# Altium project M2RB.PrjPcb (part 2 of 2)

## Sheet RF DAC.SchDoc
size B
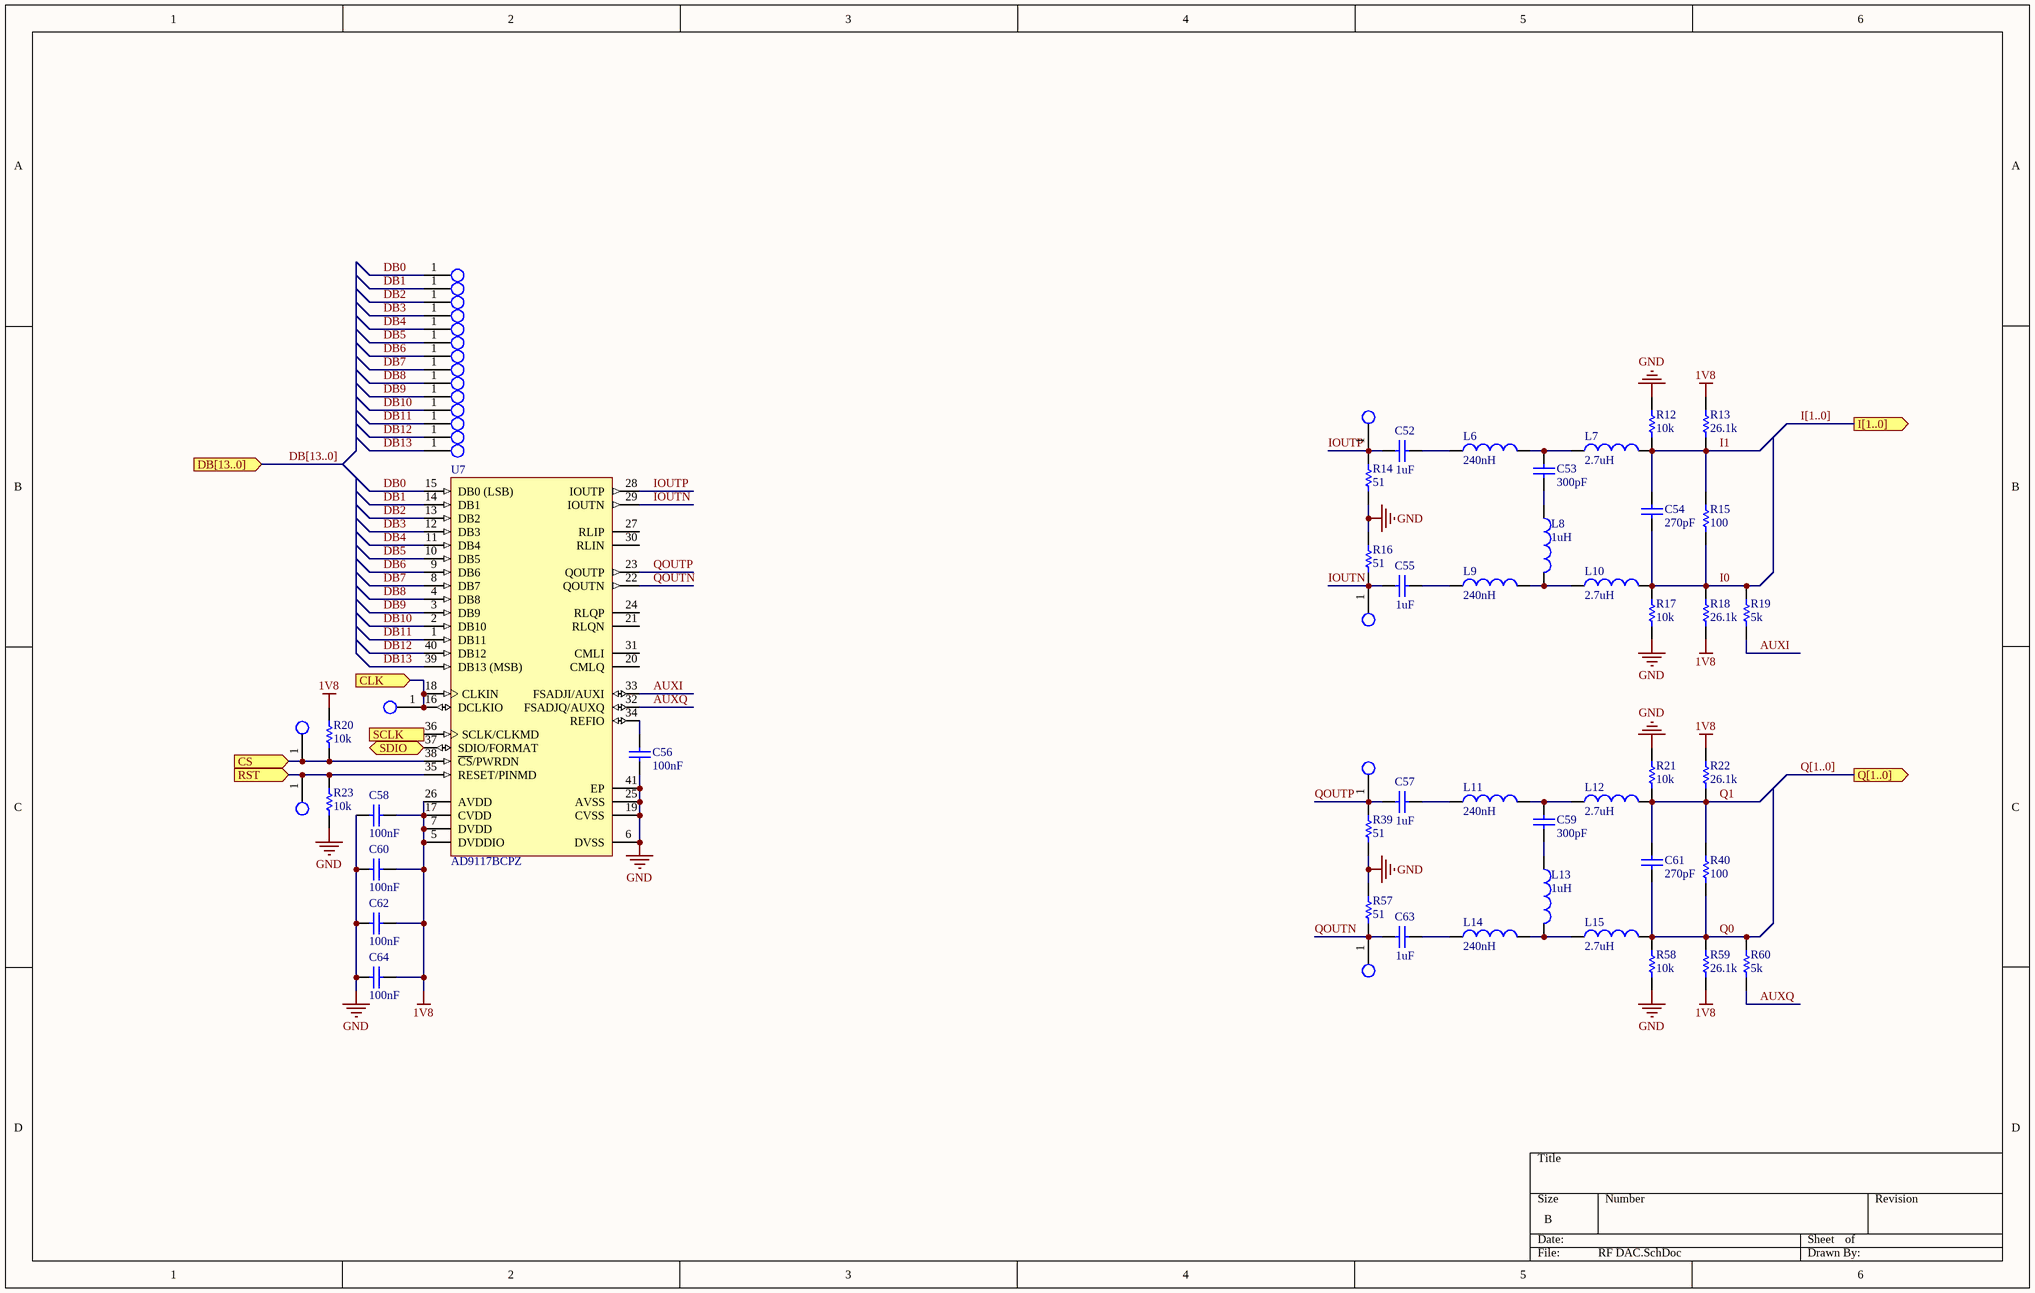
[diagram p14: RF DAC.SchDoc]

### Parts
C52  value 1uF  [1608[0603]]  (hidden comment: Cap)
C53  value 300pF  [0402-A]  (hidden comment: Cap)
C54  value 270pF  [0402-A]  (hidden comment: Cap)
C55  value 1uF  [1608[0603]]  (hidden comment: Cap)
C56  value 100nF  [0402-A]  (hidden comment: Cap)
C57  value 1uF  [1608[0603]]  (hidden comment: Cap)
C58  value 100nF  [0402-A]  (hidden comment: Cap)
C59  value 300pF  [0402-A]  (hidden comment: Cap)
C60  value 100nF  [0402-A]  (hidden comment: Cap)
C61  value 270pF  [0402-A]  (hidden comment: Cap)
C62  value 100nF  [0402-A]  (hidden comment: Cap)
C63  value 1uF  [1608[0603]]  (hidden comment: Cap)
C64  value 100nF  [0402-A]  (hidden comment: Cap)
CLK  5029  [EXPOSED PAD 0.02X0.02]  (value not drawn)
CLK3  5029  [EXPOSED PAD 0.02X0.02]  (value not drawn)
CLK4  5029  [EXPOSED PAD 0.02X0.02]  (value not drawn)
DB0  5029  [EXPOSED PAD 0.02X0.02]  (value not drawn)
DB1  5029  [EXPOSED PAD 0.02X0.02]  (value not drawn)
DB2  5029  [EXPOSED PAD 0.02X0.02]  (value not drawn)
DB3  5029  [EXPOSED PAD 0.02X0.02]  (value not drawn)
DB4  5029  [EXPOSED PAD 0.02X0.02]  (value not drawn)
DB5  5029  [EXPOSED PAD 0.02X0.02]  (value not drawn)
DB6  5029  [EXPOSED PAD 0.02X0.02]  (value not drawn)
DB7  5029  [EXPOSED PAD 0.02X0.02]  (value not drawn)
DB8  5029  [EXPOSED PAD 0.02X0.02]  (value not drawn)
DB9  5029  [EXPOSED PAD 0.02X0.02]  (value not drawn)
DB10  5029  [EXPOSED PAD 0.02X0.02]  (value not drawn)
DB11  5029  [EXPOSED PAD 0.02X0.02]  (value not drawn)
DB12  5029  [EXPOSED PAD 0.02X0.02]  (value not drawn)
DB13  5029  [EXPOSED PAD 0.02X0.02]  (value not drawn)
J22  5029  [EXPOSED PAD 0.02X0.02]  (value not drawn)
J25  5029  [EXPOSED PAD 0.02X0.02]  (value not drawn)
J26  5029  [EXPOSED PAD 0.02X0.02]  (value not drawn)
J29  5029  [EXPOSED PAD 0.02X0.02]  (value not drawn)
L6  value 240nH  [0402-A]  (hidden comment: Inductor)
L7  value 2.7uH  [1608[0603]]  (hidden comment: Inductor)
L8  value 1uH  [1608[0603]]  (hidden comment: Inductor)
L9  value 240nH  [0402-A]  (hidden comment: Inductor)
L10  value 2.7uH  [1608[0603]]  (hidden comment: Inductor)
L11  value 240nH  [0402-A]  (hidden comment: Inductor)
L12  value 2.7uH  [1608[0603]]  (hidden comment: Inductor)
L13  value 1uH  [1608[0603]]  (hidden comment: Inductor)
L14  value 240nH  [0402-A]  (hidden comment: Inductor)
L15  value 2.7uH  [1608[0603]]  (hidden comment: Inductor)
R12  value 10k  [0402-A]  (hidden comment: Res1)
R13  value 26.1k  [0402-A]  (hidden comment: Res1)
R14  value 51  [0402-A]  (hidden comment: Res1)
R15  value 100  [0402-A]  (hidden comment: Res1)
R16  value 51  [0402-A]  (hidden comment: Res1)
R17  value 10k  [0402-A]  (hidden comment: Res1)
R18  value 26.1k  [0402-A]  (hidden comment: Res1)
R19  value 5k  [0402-A]  (hidden comment: Res1)
R20  value 10k  [0402-A]  (hidden comment: Res1)
R21  value 10k  [0402-A]  (hidden comment: Res1)
R22  value 26.1k  [0402-A]  (hidden comment: Res1)
R23  value 10k  [0402-A]  (hidden comment: Res1)
R39  value 51  [0402-A]  (hidden comment: Res1)
R40  value 100  [0402-A]  (hidden comment: Res1)
R57  value 51  [0402-A]  (hidden comment: Res1)
R58  value 10k  [0402-A]  (hidden comment: Res1)
R59  value 26.1k  [0402-A]  (hidden comment: Res1)
R60  value 5k  [0402-A]  (hidden comment: Res1)
U7  AD9117BCPZ  [CP-40-1_N]

### Ports
CLK (in), CS (in), DB[13..0] (in), I[1..0] (out), Q[1..0] (out), RST (in), SCLK (in), SDIO (bidir)

### Nets
1V8: C58.2 C60.2 C62.2 C64.2 R13.2 R18.1 R20.2 R22.2 R59.1 U7.5(DVDDIO) U7.7(DVDD) U7.17(CVDD) U7.26(AVDD)
GND: C56.1 C58.1 C60.1 C62.1 C64.1 R12.2 R14.1 R16.2 R17.1 R21.2 R23.1 R39.1 R57.2 R58.1 U7.6(DVSS) U7.19(CVSS) U7.25(AVSS) U7.41(EP)
AUXI: R19.1 U7.33(FSADJI/AUXI)
AUXQ: R60.1 U7.32(FSADJQ/AUXQ)
DB0: DB0.1 U7.15(DB0_(LSB))
DB1: DB1.1 U7.14(DB1)
DB2: DB2.1 U7.13(DB2)
DB3: DB3.1 U7.12(DB3)
DB4: DB4.1 U7.11(DB4)
DB5: DB5.1 U7.10(DB5)
DB6: DB6.1 U7.9(DB6)
DB7: DB7.1 U7.8(DB7)
DB8: DB8.1 U7.4(DB8)
DB9: DB9.1 U7.3(DB9)
DB10: DB10.1 U7.2(DB10)
DB11: DB11.1 U7.1(DB11)
DB12: DB12.1 U7.40(DB12)
DB13: DB13.1 U7.39(DB13_(MSB))
I0: C54.2 L10.2 R15.1 R17.2 R18.2 R19.2
I1: C54.1 L7.2 R12.1 R13.1 R15.2
IOUTN: C55.2 J25.1 R16.1 U7.29(IOUTN)
IOUTP: C52.2 J22.1 R14.2 U7.28(IOUTP)
Q0: C61.2 L15.2 R40.1 R58.2 R59.2 R60.2
Q1: C61.1 L12.2 R21.1 R22.1 R40.2
QOUTN: C63.2 J29.1 R57.1 U7.22(QOUTN)
QOUTP: C57.2 J26.1 R39.2 U7.23(QOUTP)
NetC52_1: C52.1 L6.1
NetC53_1: C53.1 L6.2 L7.1
NetC53_2: C53.2 L8.1
NetC55_1: C55.1 L9.1
NetC56_2: C56.2 U7.34(REFIO)
NetC57_1: C57.1 L11.1
NetC59_1: C59.1 L11.2 L12.1
NetC59_2: C59.2 L13.1
NetC63_1: C63.1 L14.1
NetCLK1_1: U7.36(SCLK/CLKMD) ; port SCLK
NetCLK2_1: U7.37(SDIO/FORMAT) ; port SDIO
NetCLK3_1: CLK3.1 R20.1 U7.38(~{CS}/PWRDN) ; port CS
NetCLK4_1: CLK4.1 R23.2 U7.35(RESET/PINMD) ; port RST
NetCLK_1: CLK.1 U7.16(DCLKIO) U7.18(CLKIN) ; port CLK
NetL8_2: L8.2 L9.2 L10.1
NetL13_2: L13.2 L14.2 L15.1

Not connected (* = marked no-connect by the designer): U7 20(CMLQ) 21(RLQN) 24(RLQP) 27(RLIP) 30(RLIN) 31(CMLI)

### Buses and harness runs
bus DB[13..0] = port DB[13..0]
bus I[1..0] = port I[1..0]
bus Q[1..0] = port Q[1..0]

### Library data of the parts
C52-C64 = Cap: Capacitor; Published: 8-Jun-2000; LatestRevisionDate: 17-Jul-2002; LatestRevisionNote: Re-released for DXP Platform.; PackageReference: RAD-0.3; Publisher: Altium Limited; PackageDescription: Radial Cap, Thru-Hole; 2 Leads; 0.3 in Pin Spacing
L6-L15 = Inductor: Code_IEC: 1005; Published: 8-Jun-2000; LatestRevisionDate: 29-May-2009; LatestRevisionNote: IPC-7351 Footprint Added.; PackageReference: 0402-A; Publisher: Altium Limited; PackageDescription: Chip Inductor; Code_JEITA: 0402
R12-R23 R39 R40 R57-R60 = Res1: Resistor; Published: 8-Jun-2000; LatestRevisionDate: 17-Jul-2002; LatestRevisionNote: Re-released for DXP Platform.; PackageReference: AXIAL-0.3; Publisher: Altium Limited; PackageDescription: Axial Device, Thru-Hole; 2 Leads; 0.3 in Pin Spacing
U7 = CMP-0318-00565-2: Dual 14-Bit Low Power TxDAC Digital-to-Analog Converter, 0 to +70 degC, CP-40-1, Pb-Free, Tray; Manufacturer: Analog Devices; Generic Part Number: AD9117; Max V+: 3.3V; Single Supply: Yes; # DAC Outputs: 2; Resolution (Bits): 14; ComponentLink4Description: Product URL; ComponentLink2URL: http://www.analog.com/static/imported-files/data_sheets/AD9114_9115_9116_9117.pdf; Packing: Tray; PackageDescription: 40-Pin Lead Frame Chip Scale Package [LFCSP_VQ] Very Thin Quad; PackageVersion: Oct-2006; ComponentLink1URL: http://www.analog.com/en/index.html; Mounting Technology: Surface Mount; ComponentLink5URL: http://www.analog.com/en/digital-to-analog-converters/da-converters/ad9117/products/product.html#prod_cross_sell; ComponentLink3Description: Package Specification; PartNumber: AD9117BCPZ; PackageReference: CP-40-1; ComponentLink1Description: Manufacturer URL; ComponentLink4URL: http://www.analog.com/en/digital-to-analog-converters/da-converters/ad9117/products/product.html; ComponentLink3URL: http://www.analog.com/static/imported-files/packages/PKG_PDF/LFCSP(CP)/CP_40_1.pdf; ComponentLink2Description: Datasheet; ComponentLink5Description: Reference Design URL; Code_JEDEC: MO-220-VJJD-2; RoHS: Y; RevisionNote: Component URL fixed; DatasheetVersion: Rev.B

## Sheet LO.SchDoc
size C
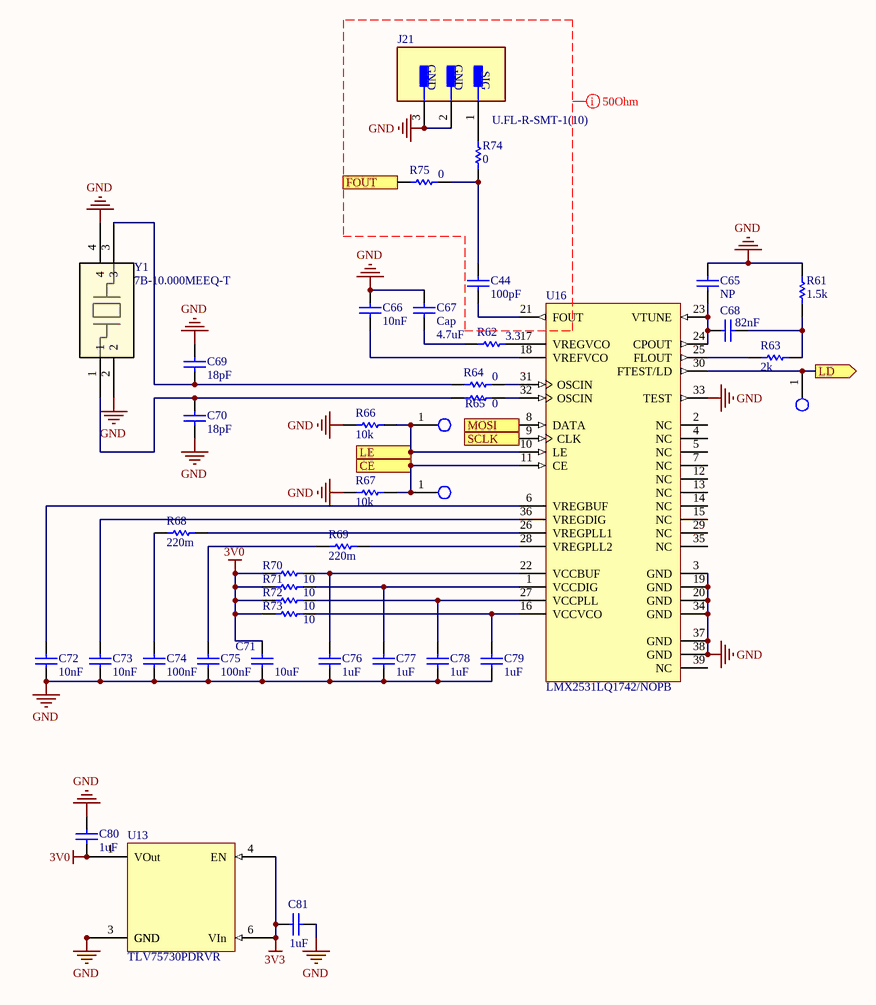
[diagram p15: LO.SchDoc]

### Parts
C44  value 100pF  [0402-A]  (hidden comment: Cap)
C65  value NP  [0402-A]  (hidden comment: Cap)
C66  value 10nF  [0402-A]  (hidden comment: Cap)
C67  Cap  value 4.7uF  [6-0805_M]
C68  value 82nF  [0402-A]  (hidden comment: Cap)
C69  value 18pF  [0402-A]  (hidden comment: Cap)
C70  value 18pF  [0402-A]  (hidden comment: Cap)
C71  value 10uF  [C1206]  (hidden comment: Cap)
C72  value 10nF  [0402-A]  (hidden comment: Cap)
C73  value 10nF  [0402-A]  (hidden comment: Cap)
C74  value 100nF  [0402-A]  (hidden comment: Cap)
C75  value 100nF  [0402-A]  (hidden comment: Cap)
C76  value 1uF  [1608[0603]]  (hidden comment: Cap)
C77  value 1uF  [1608[0603]]  (hidden comment: Cap)
C78  value 1uF  [1608[0603]]  (hidden comment: Cap)
C79  value 1uF  [1608[0603]]  (hidden comment: Cap)
C80  value 1uF  [1608[0603]]  (hidden comment: Cap)
C81  value 1uF  [1608[0603]]  (hidden comment: Cap)
CLK5  5029  [EXPOSED PAD 0.02X0.02]  (value not drawn)
CLK6  5029  [EXPOSED PAD 0.02X0.02]  (value not drawn)
CLK7  5029  [EXPOSED PAD 0.02X0.02]  (value not drawn)
J21  U.FL-R-SMT-1(10)  [FP-U_FL-R-SMT-1_10-MFG]
R61  value 1.5k  [0402-A]  (hidden comment: Res1)
R62  value 3.3  [0402-A]  (hidden comment: Res1)
R63  value 2k  [0402-A]  (hidden comment: Res1)
R64  value 0  [0402-A]  (hidden comment: Res1)
R65  value 0  [0402-A]  (hidden comment: Res1)
R66  value 10k  [0402-A]  (hidden comment: Res1)
R67  value 10k  [0402-A]  (hidden comment: Res1)
R68  value 220m  [0402-A]  (hidden comment: Res1)
R69  value 220m  [0402-A]  (hidden comment: Res1)
R70  value 10  [0402-A]  (hidden comment: Res1)
R71  value 10  [0402-A]  (hidden comment: Res1)
R72  value 10  [0402-A]  (hidden comment: Res1)
R73  value 10  [0402-A]  (hidden comment: Res1)
R74  value 0  [0402-A]  (hidden comment: Res1)
R75  value 0  [0402-A]  (hidden comment: Res1)
U13  TLV75730PDRVR  [TLV75730PDRVR]
U16  LMX2531LQ1742/NOPB  [NJG0036A_V]
Y1  7B-10.000MEEQ-T  [CRYSTAL_TXC_7B]

### Ports
CE (in), FOUT (out), LD (out), LE (in), MOSI (in), SCLK (in)

### Nets
3V0: C71.2 C80.2 R70.2 R71.2 R72.2 R73.2 U13.1(VOut)
3V3: C81.2 U13.4(EN) U13.6(VIn)
GND: C65.1 C66.2 C67.2 C69.2 C70.1 C71.1 C72.1 C73.1 C74.1 C75.1 C76.2 C77.2 C78.2 C79.2 C80.1 C81.1 J21.2(GND) J21.3(GND) R61.1 R66.1 R67.1 U13.3(GND) U13.7(GND) U16.3(GND) U16.19(GND) U16.20(GND) U16.33(TEST) U16.34(GND) U16.37(GND) U16.38(GND) Y1.2 Y1.4
NetC44_1: C44.1 R74.2 R75.1
NetC44_2: C44.2 U16.21(FOUT)
NetC65_2: C65.2 C68.2 U16.23(VTUNE) U16.24(CPOUT)
NetC66_1: C66.1 U16.18(VREFVCO)
NetC67_1: C67.1 R62.2
NetC68_1: C68.1 R61.2 R63.2
NetC69_1: C69.1 R64.2 Y1.3
NetC70_2: C70.2 R65.2 Y1.1
NetC72_2: C72.2 U16.6(VREGBUF)
NetC73_2: C73.2 U16.36(VREGDIG)
NetC74_2: C74.2 R68.2
NetC75_2: C75.2 R69.2
NetC76_1: C76.1 R70.1 U16.22(VCCBUF)
NetC77_1: C77.1 R71.1 U16.1(VCCDIG)
NetC78_1: C78.1 R72.1 U16.27(VCCPLL)
NetC79_1: C79.1 R73.1 U16.16(VCCVCO)
NetCLK1_1: U16.9(CLK) ; port SCLK
NetCLK2_1: U16.8(DATA) ; port MOSI
NetCLK5_1: CLK5.1 U16.30(FTEST/LD) ; port LD
NetCLK6_1: CLK6.1 R66.2 U16.10(LE) ; port LE
NetCLK7_1: CLK7.1 R67.2 U16.11(CE) ; port CE
NetJ21_1: J21.1(SIG) R74.1
NetR62_1: R62.1 U16.17(VREGVCO)
NetR63_1: R63.1 U16.25(FLOUT)
NetR64_1: R64.1 U16.31(OSCIN)
NetR65_1: R65.1 U16.32(OSCIN)
NetR68_1: R68.1 U16.26(VREGPLL1)
NetR69_1: R69.1 U16.28(VREGPLL2)
NetR75_2: R75.2 ; port FOUT

Not connected (* = marked no-connect by the designer): U16 2(NC) 4(NC) 5(NC) 7(NC) 12(NC) 13(NC) 14(NC) 15(NC) 29(NC) 35(NC) 39(NC)

### Layout directives
net class 50Ohm: GND

### Library data of the parts
C44 C65-C81 = Cap: Capacitor; Published: 8-Jun-2000; LatestRevisionDate: 17-Jul-2002; LatestRevisionNote: Re-released for DXP Platform.; PackageReference: RAD-0.3; Publisher: Altium Limited; PackageDescription: Radial Cap, Thru-Hole; 2 Leads; 0.3 in Pin Spacing
  C67: Supplier 1: Digi-Key; Supplier Part Number 1: 490-14466-1-ND
J21 = CMP-2000-05152-2: CONN U.FL RCPT STR 50 OHM SMD; Body Plating: Silver; Impedance: 50R; Frequency: 6GHz; Connector Type: Coaxial; Dielectric Material: Polymer; Insulation Resistance: 500MR; Body Material: Bronze; Gender: Male; REACH SVHC: No SVHC; Depth: 3.1mm; Housing Color: Beige; Contact Material: Brass; Package Quantity: 2500; Max Frequency: 6GHz; Radiation Hardening: No; Packaging: Tape and Reel; Termination: Solder; Lead Free: Lead Free; Wire/Cable Type: Coaxial; Min Operating Temperature: -40°C; Max Operating Temperature: 90°C; Contact Plating: Gold; Mount: Surface Mount; Fastening Type: Snap; Orientation: Straight; Length: 3mm
R61-R75 = Res1: Resistor; Published: 8-Jun-2000; LatestRevisionDate: 17-Jul-2002; LatestRevisionNote: Re-released for DXP Platform.; PackageReference: AXIAL-0.3; Publisher: Altium Limited; PackageDescription: Axial Device, Thru-Hole; 2 Leads; 0.3 in Pin Spacing
U16 = CMP-0058-00556-3: High Performance Frequency Synthesizer System with Integrated VCO, 36-pin LLP, Pb-Free; Manufacturer: Texas Instruments; CompType: Interface IC; PowerWise: Y; PackageTopMarking: NS*UZXYTTE#*311742A; RoHS: Y; PinCount: 36; PackageDescription: LLP, Plastic, Quad, 6 x 6 x 0.8mm Body, 36 Lead, 0.5mm Pitch, Custom; ComponentLink1URL: http://www.ti.com/general/docs/lit/getliterature.tsp?genericPartNumber=LMX2531&fileType=pdf; ComponentLink1Description: Datasheet URL; PackageReference: NJG0036A
Y1 = 7B-10.000MEEQ-T: No Description Available; Vendor: TXC; Built_By: EMA_UL_Team; Manufacturer_Part_Number: 7B-10.000MEEQ-T; Copyright: Copyright (C) 2018 Accelerated Designs. All rights reserved; RefDes: RefDes; Type: DEV

## Nets that join several sheets
1V0: FPGA Power (26 pins), 1V0 Rail (C18#2.1 U12.4)
1V8: Daughter Board (J1.0 R3.2), FPGA Power (10 pins), FPGA Data (39 pins), Ethernet (11 pins), 1V0 Rail (C17#2.1 U12.1 U12.6), SPIflash (C19#2.1 R36.1 R37.1 U2.8), RF DAC (13 pins)
3V3: Power Amplifier (7 pins), Daughter Board (J1.23 R2.2), nRF52832 (7 pins), Ethernet (8 pins), CAN 3V3 (C86.1 C87.2 U5.9 U6.3), LSM6DSMTR (C3.2 C4.2 U10.5 U10.8), TMP235AQDB2TQ1 (C2.1 U1.1), LO (C81.2 U13.4 U13.6)
5V0: Daughter Board (J1.1 R1.2), Modulator (14 pins)
GND: Power Amplifier (33 pins), Daughter Board (8 pins), nRF52832 (25 pins), FPGA Power (69 pins), FPGA Data (37 pins), Ethernet (21 pins), 1V0 Rail (C17#2.2 C18#2.2 U12.2 U12.7), SPIflash (C19#2.2 U2.4 U2.9), CAN 3V3 (8 pins), LSM6DSMTR (6 pins), TMP235AQDB2TQ1 (C1.2 C2.2 U1.3), Modulator (21 pins), RF DAC (18 pins), LO (32 pins)
COL: FPGA Data (U11.M2), Ethernet (U14#2.36)
CRS: FPGA Data (U11.L2), Ethernet (U14#2.3)
DB0: FPGA Data (U11.N14), RF DAC (DB0.1 U7.15)
DB1: FPGA Data (U11.M14), RF DAC (DB1.1 U7.14)
DB2: FPGA Data (U11.L14), RF DAC (DB2.1 U7.13)
DB3: FPGA Data (U11.J13), RF DAC (DB3.1 U7.12)
DB4: FPGA Data (U11.J14), RF DAC (DB4.1 U7.11)
DB5: FPGA Data (U11.G14), RF DAC (DB5.1 U7.10)
DB6: FPGA Data (U11.F14), RF DAC (DB6.1 U7.9)
DB7: FPGA Data (U11.F13), RF DAC (DB7.1 U7.8)
DB8: FPGA Data (U11.E13), RF DAC (DB8.1 U7.4)
DB9: FPGA Data (U11.D14), RF DAC (DB9.1 U7.3)
DB10: FPGA Data (U11.C14), RF DAC (DB10.1 U7.2)
DB11: FPGA Data (U11.C12), RF DAC (DB11.1 U7.1)
DB12: FPGA Data (U11.B14), RF DAC (DB12.1 U7.40)
DB13: FPGA Data (U11.B13), RF DAC (DB13.1 U7.39)
EN: Power Amplifier (R76.1 U14#1.1 U24.1 U25.1), FPGA Data (CLK8.1 U11.M13)
ETHRST: FPGA Data (U11.J1), Ethernet (C8.2 R41.2 U14#2.5)
I0: Modulator (U3.20), RF DAC (6 pins)
I1: Modulator (U3.19), RF DAC (5 pins)
MDC: FPGA Data (U11.M1), Ethernet (U14#2.2)
MDIO: FPGA Data (U11.L1), Ethernet (R5.1 U14#2.4)
NetC1_1: nRF52832 (U9.4), TMP235AQDB2TQ1 (C1.1 R4.2)
NetC5_2: Daughter Board (J1.21), CAN 3V3 (C5.2 U4.1 U6.7)
NetC18#1_1: Power Amplifier (C18#1.1), Modulator (R8.1)
NetC85_2: Daughter Board (J1.20), CAN 3V3 (C85.2 U4.2 U6.6)
NetCLK1_1: FPGA Data (CLK1.1 U11.N11), RF DAC (U7.36), LO (U16.9)
NetCLK2_1: FPGA Data (CLK2.1 U11.P11), RF DAC (U7.37), LO (U16.8)
NetCLK3_1: FPGA Data (U11.P12), RF DAC (CLK3.1 R20.1 U7.38)
NetCLK4_1: FPGA Data (U11.P10), RF DAC (CLK4.1 R23.2 U7.35)
NetCLK5_1: FPGA Data (U11.N10), LO (CLK5.1 U16.30)
NetCLK6_1: FPGA Data (U11.P5), LO (CLK6.1 R66.2 U16.10)
NetCLK7_1: FPGA Data (U11.P4), LO (CLK7.1 R67.2 U16.11)
NetCLK_1: FPGA Data (U11.P13), RF DAC (CLK.1 U7.16 U7.18)
NetJ1_18: Daughter Board (J1.18), nRF52832 (U9.28)
NetJ1_19: Daughter Board (J1.19), nRF52832 (U9.27)
NetR27_1: FPGA Data (R27.1 U11.C11), SPIflash (U2.1)
NetR75_2: Modulator (U3.8), LO (R75.2)
NetU2_2: FPGA Data (U11.B12), SPIflash (U2.2)
NetU2_5: FPGA Data (U11.B11), SPIflash (U2.5)
NetU2_6: FPGA Data (U11.A8), SPIflash (U2.6)
NetU5_4: nRF52832 (U9.20), CAN 3V3 (U5.4)
NetU5_5: nRF52832 (U9.22), CAN 3V3 (U5.5)
NetU5_6: nRF52832 (U9.23), CAN 3V3 (U5.6)
NetU5_10: nRF52832 (U9.11), CAN 3V3 (U5.10)
NetU5_11: nRF52832 (U9.12), CAN 3V3 (U5.11)
NetU5_12: nRF52832 (U9.14), CAN 3V3 (U5.12)
NetU5_13: nRF52832 (U9.15), CAN 3V3 (U5.13), LSM6DSMTR (U10.13)
NetU5_14: nRF52832 (U9.16), CAN 3V3 (U5.14), LSM6DSMTR (U10.14)
NetU5_15: nRF52832 (U9.17), CAN 3V3 (U5.15), LSM6DSMTR (U10.1)
NetU5_16: nRF52832 (U9.18), CAN 3V3 (U5.16)
NetU5_17: nRF52832 (U9.19), CAN 3V3 (U5.17)
NetU9_5: nRF52832 (U9.5), LSM6DSMTR (U10.12)
Q0: Modulator (U3.23), RF DAC (6 pins)
Q1: Modulator (U3.24), RF DAC (5 pins)
RXC: FPGA Data (U11.D1), Ethernet (U14#2.20)
RXD0: FPGA Data (U11.E2), Ethernet (R56.2 U14#2.18)
RXD1: FPGA Data (U11.F1), Ethernet (R55.2 U14#2.17)
RXD2: FPGA Data (U11.F2), Ethernet (R54.2 U14#2.16)
RXD3: FPGA Data (U11.G1), Ethernet (R53.2 U14#2.15)
RXDV: FPGA Data (U11.D2), Ethernet (U14#2.19)
RXER: FPGA Data (U11.C1), Ethernet (U14#2.21)
TXC: FPGA Data (U11.G4), Ethernet (U14#2.22)
TXD0: FPGA Data (U11.B2), Ethernet (U14#2.23)
TXD1: FPGA Data (U11.B1), Ethernet (U14#2.24)
TXD2: FPGA Data (U11.A2), Ethernet (U14#2.26)
TXD3: FPGA Data (U11.A3), Ethernet (U14#2.27)
TXEN: FPGA Data (U11.H2), Ethernet (U14#2.6)
TXER: FPGA Data (U11.N1), Ethernet (U14#2.1)